# Altium schematic sheet Dust1_Motherboard_TOP.SchDoc
size A4; SheetNumber: 1; SheetTotal: 5
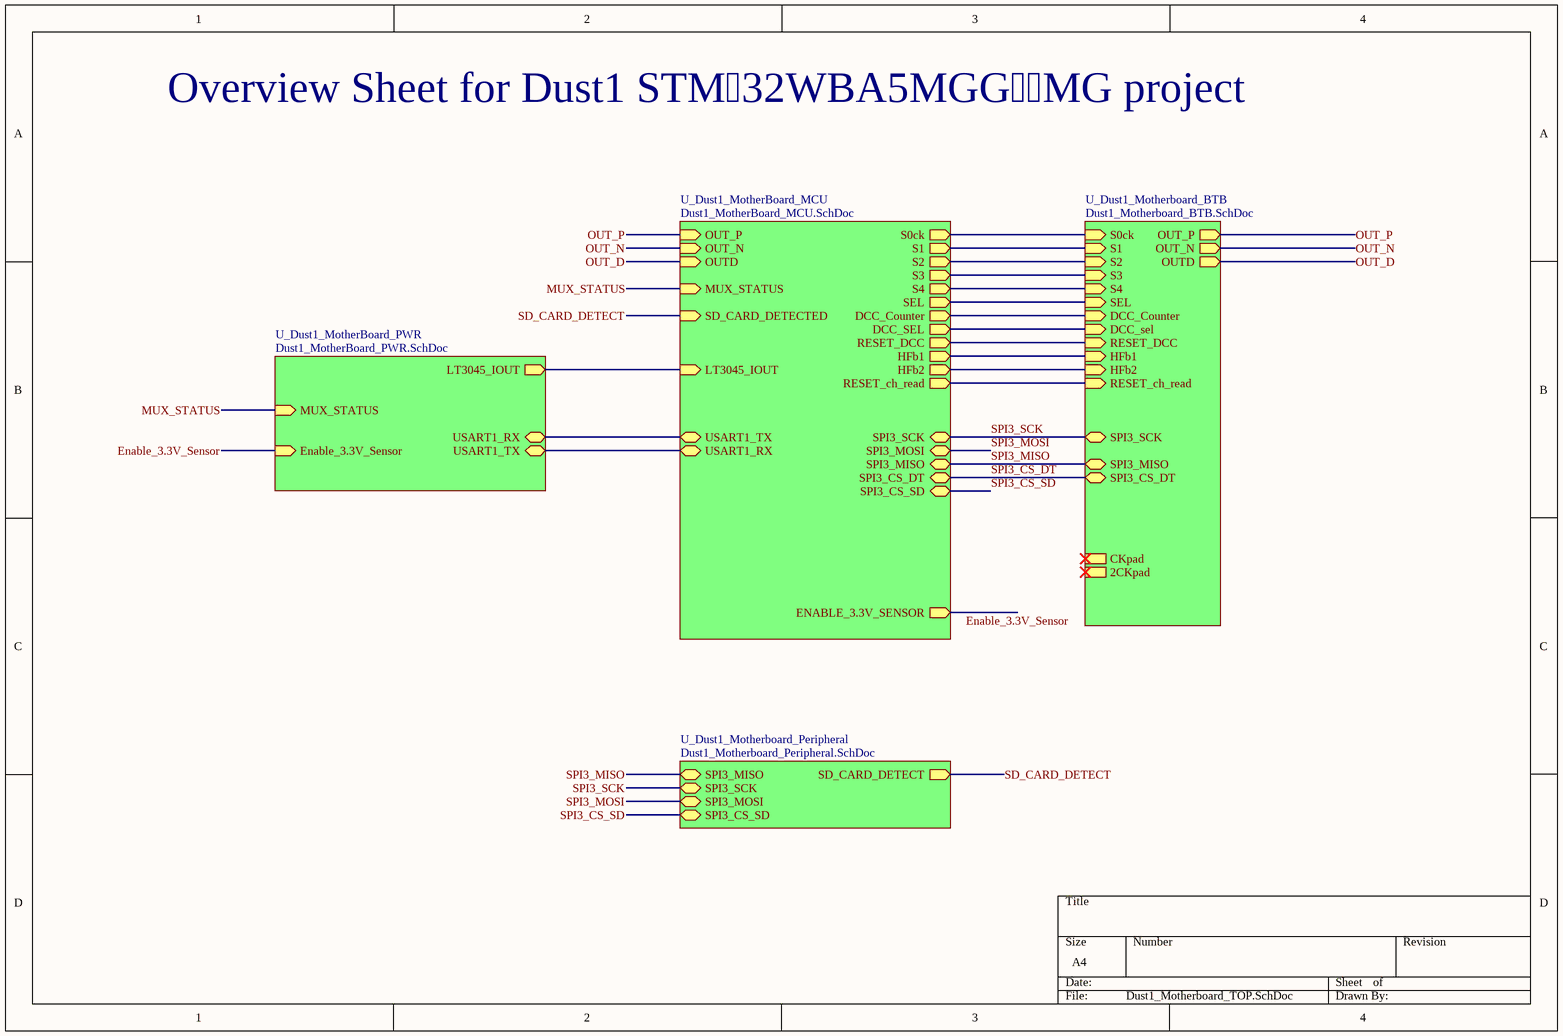
[diagram p0: Dust1_Motherboard_TOP.SchDoc]

## Sub-sheets
U_Dust1_Motherboard_BTB = Dust1_Motherboard_BTB.SchDoc: OUT_P (out), OUT_N (out), DCC_Counter (in), OUTD (out), CKpad, 2CKpad, DCC_sel (in), RESET_DCC (in), S4 (in), S3 (in), S2 (in), S1 (in), SEL (in), SPI3_SCK (bidir), SPI3_MISO (bidir), SPI3_CS_DT (bidir), RESET_ch_read (in), HFb1 (in), HFb2 (in), S0ck (in)
U_Dust1_MotherBoard_MCU = Dust1_MotherBoard_MCU.SchDoc: SPI3_CS_DT (bidir), SPI3_MOSI (bidir), SPI3_MISO (bidir), SPI3_SCK (bidir), SPI3_CS_SD (bidir), USART1_TX (bidir), LT3045_IOUT (in), S0ck (out), S1 (out), S2 (out), S3 (out), S4 (out), SEL (out), DCC_Counter (out), DCC_SEL (out), OUTD (in), RESET_DCC (out), HFb1 (out), HFb2 (out), USART1_RX (bidir), ENABLE_3.3V_SENSOR (out), SD_CARD_DETECTED (in), RESET_ch_read (out), OUT_P (in), OUT_N (in), MUX_STATUS (in)
U_Dust1_Motherboard_Peripheral = Dust1_Motherboard_Peripheral.SchDoc: SPI3_MISO (bidir), SPI3_SCK (bidir), SPI3_MOSI (bidir), SPI3_CS_SD (bidir), SD_CARD_DETECT (out)
U_Dust1_MotherBoard_PWR = Dust1_MotherBoard_PWR.SchDoc: USART1_RX (bidir), USART1_TX (bidir), MUX_STATUS (in), Enable_3.3V_Sensor (in), LT3045_IOUT (out)

## Nets
Enable_3.3V_Sensor: sheet U_Dust1_MotherBoard_MCU/ENABLE_3.3V_SENSOR, sheet U_Dust1_MotherBoard_PWR/Enable_3.3V_Sensor
MUX_STATUS: sheet U_Dust1_MotherBoard_MCU/MUX_STATUS, sheet U_Dust1_MotherBoard_PWR/MUX_STATUS
OUT_D: sheet U_Dust1_Motherboard_BTB/OUTD, sheet U_Dust1_MotherBoard_MCU/OUTD
OUT_N: sheet U_Dust1_Motherboard_BTB/OUT_N, sheet U_Dust1_MotherBoard_MCU/OUT_N
OUT_P: sheet U_Dust1_Motherboard_BTB/OUT_P, sheet U_Dust1_MotherBoard_MCU/OUT_P
SD_CARD_DETECT: sheet U_Dust1_MotherBoard_MCU/SD_CARD_DETECTED, sheet U_Dust1_Motherboard_Peripheral/SD_CARD_DETECT
SPI3_CS_DT: sheet U_Dust1_Motherboard_BTB/SPI3_CS_DT, sheet U_Dust1_MotherBoard_MCU/SPI3_CS_DT
SPI3_CS_SD: sheet U_Dust1_MotherBoard_MCU/SPI3_CS_SD, sheet U_Dust1_Motherboard_Peripheral/SPI3_CS_SD
SPI3_MISO: sheet U_Dust1_Motherboard_BTB/SPI3_MISO, sheet U_Dust1_MotherBoard_MCU/SPI3_MISO, sheet U_Dust1_Motherboard_Peripheral/SPI3_MISO
SPI3_MOSI: sheet U_Dust1_MotherBoard_MCU/SPI3_MOSI, sheet U_Dust1_Motherboard_Peripheral/SPI3_MOSI
SPI3_SCK: sheet U_Dust1_Motherboard_BTB/SPI3_SCK, sheet U_Dust1_MotherBoard_MCU/SPI3_SCK, sheet U_Dust1_Motherboard_Peripheral/SPI3_SCK
(unnamed): sheet U_Dust1_Motherboard_BTB/DCC_Counter, sheet U_Dust1_MotherBoard_MCU/DCC_Counter
(unnamed): sheet U_Dust1_Motherboard_BTB/DCC_sel, sheet U_Dust1_MotherBoard_MCU/DCC_SEL
(unnamed): sheet U_Dust1_Motherboard_BTB/RESET_DCC, sheet U_Dust1_MotherBoard_MCU/RESET_DCC
(unnamed): sheet U_Dust1_Motherboard_BTB/S4, sheet U_Dust1_MotherBoard_MCU/S4
(unnamed): sheet U_Dust1_Motherboard_BTB/S3, sheet U_Dust1_MotherBoard_MCU/S3
(unnamed): sheet U_Dust1_Motherboard_BTB/S2, sheet U_Dust1_MotherBoard_MCU/S2
(unnamed): sheet U_Dust1_Motherboard_BTB/S1, sheet U_Dust1_MotherBoard_MCU/S1
(unnamed): sheet U_Dust1_Motherboard_BTB/SEL, sheet U_Dust1_MotherBoard_MCU/SEL
(unnamed): sheet U_Dust1_Motherboard_BTB/RESET_ch_read, sheet U_Dust1_MotherBoard_MCU/RESET_ch_read
(unnamed): sheet U_Dust1_Motherboard_BTB/HFb1, sheet U_Dust1_MotherBoard_MCU/HFb1
(unnamed): sheet U_Dust1_Motherboard_BTB/HFb2, sheet U_Dust1_MotherBoard_MCU/HFb2
(unnamed): sheet U_Dust1_Motherboard_BTB/S0ck, sheet U_Dust1_MotherBoard_MCU/S0ck
(unnamed): sheet U_Dust1_MotherBoard_MCU/USART1_TX, sheet U_Dust1_MotherBoard_PWR/USART1_RX
(unnamed): sheet U_Dust1_MotherBoard_MCU/LT3045_IOUT, sheet U_Dust1_MotherBoard_PWR/LT3045_IOUT
(unnamed): sheet U_Dust1_MotherBoard_MCU/USART1_RX, sheet U_Dust1_MotherBoard_PWR/USART1_TX

## Notes on the sheet
- Overview Sheet for Dust1 STM32WBA5MGGMG project